# EAGLE design QiLiCape-main-v035 (EAGLE 6.3)
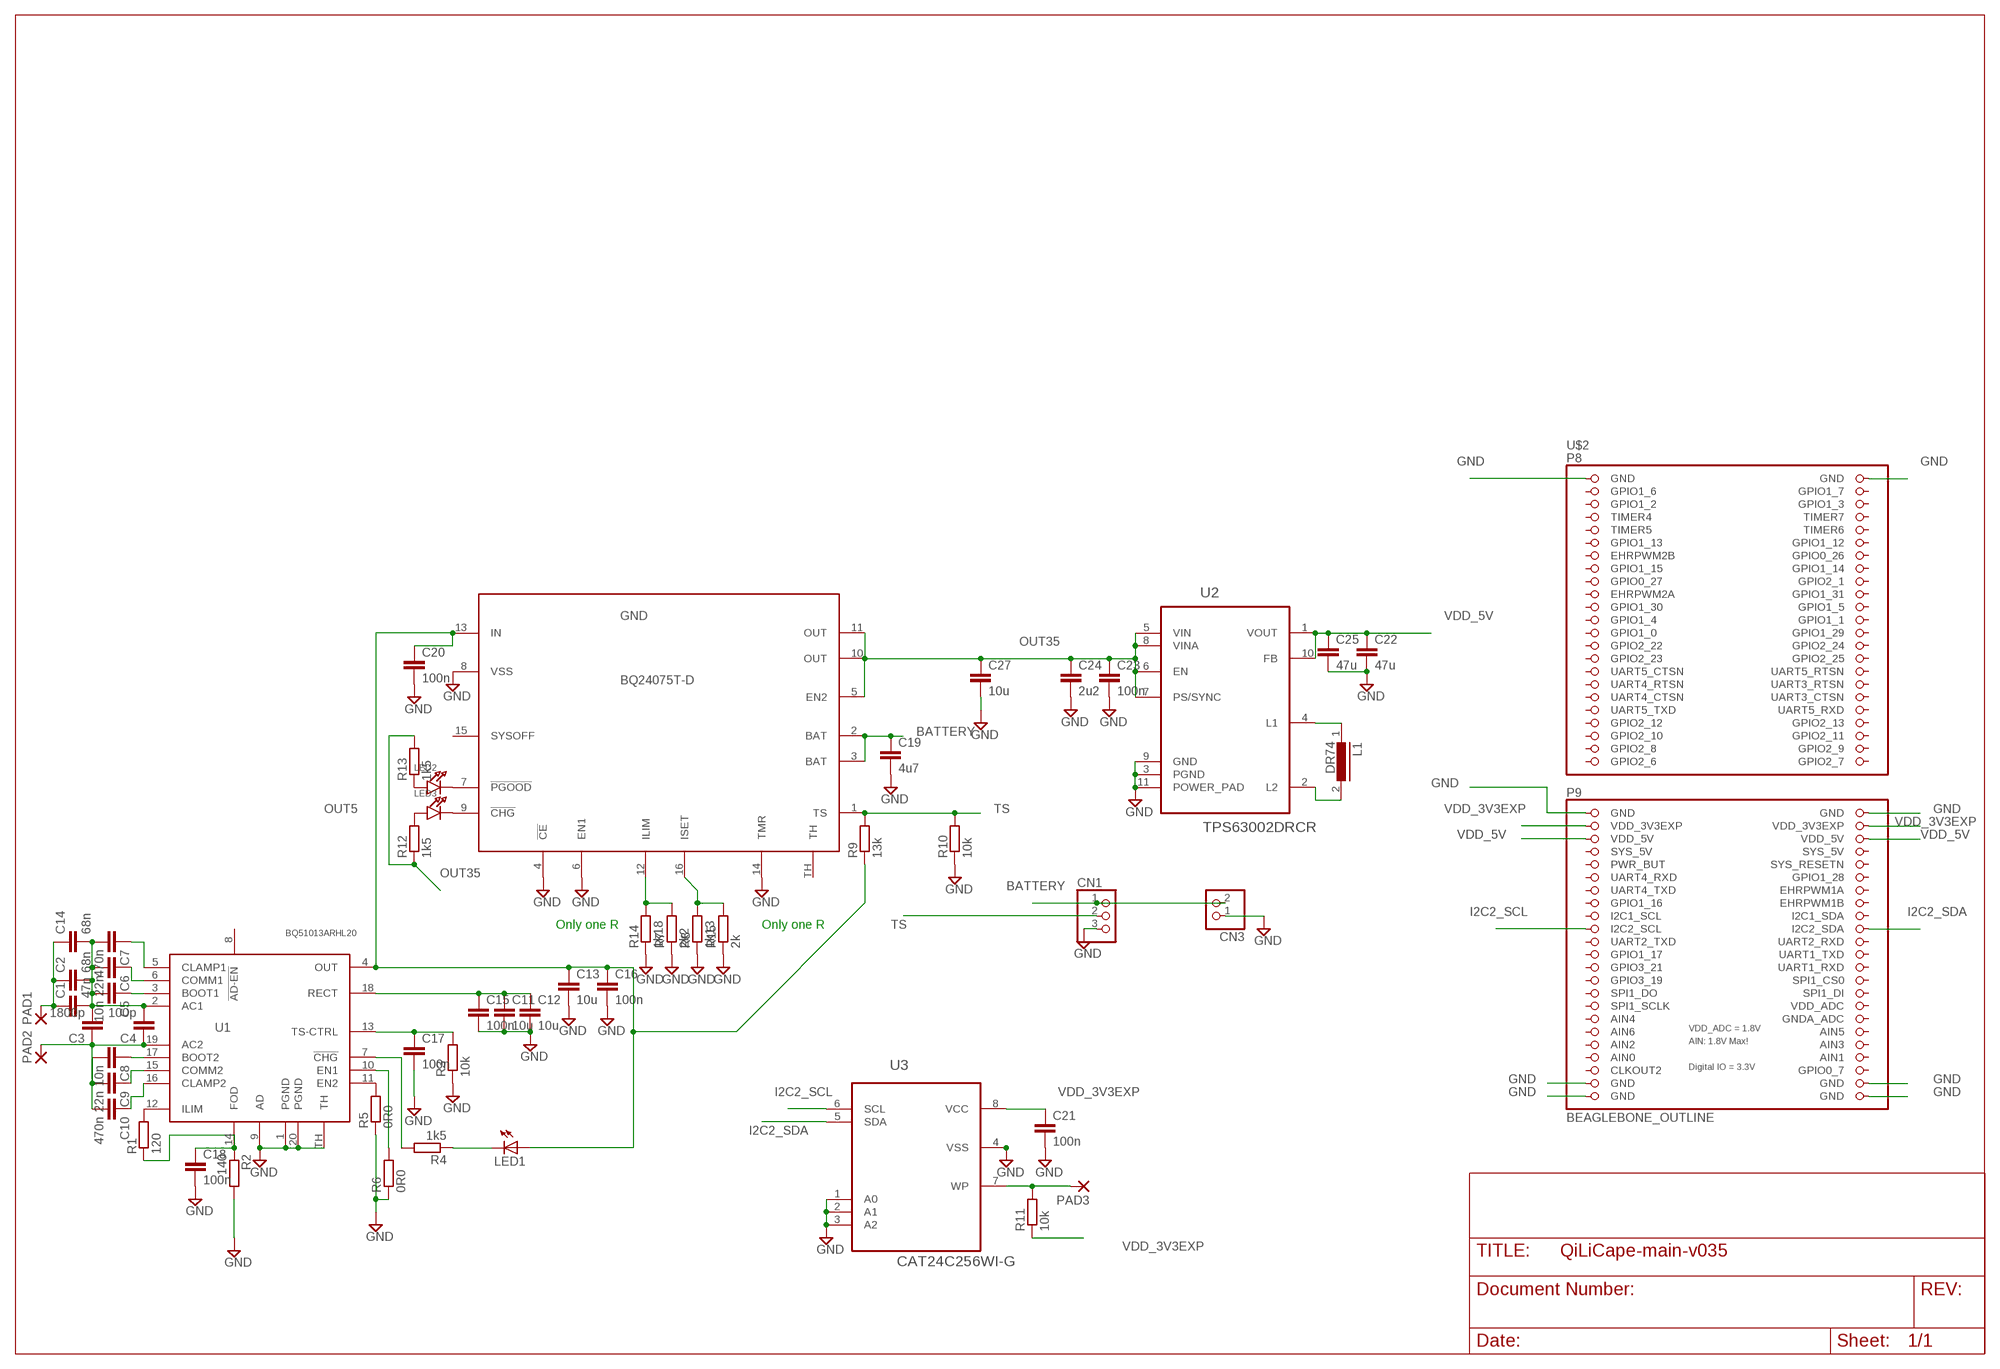
[diagram p0: schematic, sheet 1]

## Parts
C1  47n  C-EUC0603K  [C0603K]
C2  68n  C-EUC0603K  [C0603K]
C3  1800p  C-EUC0603K  [C0603K]
C4  100p  C-EUC0603K  [C0603K]
C5  10n  C-EUC0603K  [C0603K]
C6  22n  C-EUC0603K  [C0603K]
C7  470n  C-EUC0603K  [C0603K]
C8  10n  C-EUC0603K  [C0603K]
C9  22n  C-EUC0603K  [C0603K]
C10  470n  C-EUC0603K  [C0603K]
C11  10u  C-EUC1206  [C1206]
C12  10u  C-EUC1206  [C1206]
C13  10u  C-EUC1206  [C1206]
C14  68n  C-EUC0603K  [C0603K]
C15  100n  C-EUC0805K  [C0805K]
C16  100n  C-EUC0603K  [C0603K]
C17  100n  C-EUC0603K  [C0603K]
C18  100n  C-EUC0603K  [C0603K]
C19  4u7  C-EUC0805K  [C0805K]
C20  100n  C-EUC0603K  [C0603K]
C21  100n  C-EUC0402K  [C0402K]
C22  47u  C-EUC1206K  [C1206K]
C23  100n  C-EUC0603  [C0603]
C24  2u2  C-EUC0805K  [C0805K]
C25  47u  C-EUC1812K  [C1812K]
C27  10u  C-EUC1206K  [C1206K]
CN1  JST_3PIN  [JSTPH3]
CN3  JST_2PIN  [JSTPH2]
GND  BQ24075T-D  [QFN16-3]
L1  DR74  [DR74]
LED1  LEDSML0805  [SML0805]
LED2  LED0603  [CHIPLED_0603]
LED3  LED0603  [CHIPLED_0603]
PAD1  2,54/1,0  [2,54/1,0]
PAD2  2,54/1,1  [2,54/1,1]
PAD3  SMD2  [SMD1,27-2,54]
R1  120  R-EU_R0603  [R0603]
R2  140  R-EU_R0603  [R0603]
R3  10k  R-EU_R0603  [R0603]
R4  1k5  R-EU_R0603  [R0603]
R5  0R0  R-EU_R0805  [R0805]
R6  0R0  R-EU_R0805  [R0805]
R7  2k2  R-EU_R0603  [R0603]
R8  1k13  R-EU_R0603  [R0603]
R9  13k  R-EU_R0603  [R0603]
R10  10k  R-EU_R0603  [R0603]
R11  10k  R-EU_R0402  [R0402]
R12  1k5  R-EU_R0603  [R0603]
R13  1k5  R-EU_R0603  [R0603]
R14  1k18  R-EU_R0603  [R0603]
R15  2k  R-EU_R0603  [R0603]
U1  BQ51013ARHL20  [RHL]
U2  TPS63002DRCR  [SON50P300X300X100-11N]
U3  CAT24C256WI-G  [SOIC127P600X175-8N]
U$2  BEAGLEBONE_OUTLINE  [BEAGLEBONE_SHIELD]

## Nets
AC1: C1.2 C2.2 C3.2 C4.2 C5.2 C6.2 C7.2 C14.2 U1.2(AC1)
AC1-1: C1.1 C2.1 C14.1 PAD1.1(P)
AC2: C3.1 C4.1 C8.2 C9.2 C10.2 PAD2.1(P) U1.19(AC2)
BATTERY: C19.1 CN1.1 CN3.2 GND.2(BAT) GND.3(BAT)
GND: C11.2 C12.2 C13.2 C15.2 C16.2 C17.2 C18.2 C19.2 C20.2 C21.2 C22.2 C23.2 C24.2 C25.2 C27.2 CN1.3 CN3.1 GND.4(!CE) GND.6(EN1) GND.8(VSS) GND.14(TMR) R2.2 R3.1 R5.1 R6.1 R7.1 R8.1 R10.1 R14.1 R15.1 U1.1(PGND) U1.9(AD) U1.20(PGND) U1.TH U2.3(PGND) U2.9(GND) U2.11(POWER_PAD) U3.1(A0) U3.2(A1) U3.3(A2) U3.4(VSS) U$2.1(GND) U$2.2(GND) U$2.47(GND) U$2.48(GND) U$2.89(GND) U$2.90(GND) U$2.91(GND) U$2.92(GND)
I2C2_SCL: U3.6(SCL) U$2.65(I2C2_SCL)
I2C2_SDA: U3.5(SDA) U$2.66(I2C2_SDA)
N$1: C11.1 C12.1 C15.1 U1.18(RECT)
N$2: C5.1 U1.3(BOOT1)
N$3: C6.1 U1.6(COMM1)
N$4: C7.1 U1.5(CLAMP1)
N$5: C8.1 U1.17(BOOT2)
N$6: C9.1 U1.15(COMM2)
N$7: C10.1 U1.16(CLAMP2)
N$10: C17.1 R3.2 U1.13(TS-CTRL)
N$14: GND.7(!PGOOD) LED2.C
N$15: LED1.C R4.1
N$16: R4.2 U1.7(!CHG!)
N$17: R6.2 U1.10(EN1)
N$18: R5.2 U1.11(EN2)
N$19: PAD3.1(P) R11.2 U3.7(WP)
N$20: GND.12(ILIM) R7.2 R14.2
N$21: GND.16(ISET) R8.2 R15.2
N$24: L1.1 U2.4(L1)
N$25: L1.2 U2.2(L2)
N$26: GND.9(!CHG) LED3.C
N$27: LED3.A R12.2
N$29: LED2.A R13.1
N$33: R1.2 U1.12(ILIM)
N$34: C18.1 R1.1 R2.1 U1.14(FOD)
OUT5: C13.1 C16.1 C20.1 GND.13(IN) LED1.A R9.1 U1.4(OUT)
OUT35: C23.1 C24.1 C27.1 GND.5(EN2) GND.10(OUT) GND.11(OUT) R12.1 R13.2 U2.5(VIN) U2.6(EN) U2.7(PS/SYNC) U2.8(VINA)
TS: CN1.2 GND.1(TS) R9.2 R10.2
VDD_3V3EXP: C21.1 R11.1 U3.8(VCC) U$2.49(VDD_3V3EXP) U$2.50(VDD_3V3EXP)
VDD_5V: C22.1 C25.1 U2.1(VOUT) U2.10(FB) U$2.51(VDD_5V) U$2.52(VDD_5V)
Unconnected: GND.15(SYSOFF) GND.TH U1.8(!AD-EN!) U$2.3(GPIO1_6) U$2.4(GPIO1_7) U$2.5(GPIO1_2) U$2.6(GPIO1_3) U$2.7(TIMER4) U$2.8(TIMER7) U$2.9(TIMER5) U$2.10(TIMER6) U$2.11(GPIO1_13) U$2.12(GPIO1_12) U$2.13(EHRPWM2B) U$2.14(GPIO0_26) U$2.15(GPIO1_15) U$2.16(GPIO1_14) U$2.17(GPIO0_27) U$2.18(GPIO2_1) U$2.19(EHRPWM2A) U$2.20(GPIO1_31) U$2.21(GPIO1_30) U$2.22(GPIO1_5) U$2.23(GPIO1_4) U$2.24(GPIO1_1) U$2.25(GPIO1_0) U$2.26(GPIO1_29) U$2.27(GPIO2_22) U$2.28(GPIO2_24) U$2.29(GPIO2_23) U$2.30(GPIO2_25) U$2.31(UART5_CTSN) U$2.32(UART5_RTSN) U$2.33(UART4_RTSN) U$2.34(UART3_RTSN) U$2.35(UART4_CTSN) U$2.36(UART3_CTSN) U$2.37(UART5_TXD) U$2.38(UART5_RXD) U$2.39(GPIO2_12) U$2.40(GPIO2_13) U$2.41(GPIO2_10) U$2.42(GPIO2_11) U$2.43(GPIO2_8) U$2.44(GPIO2_9) U$2.45(GPIO2_6) U$2.46(GPIO2_7) U$2.55(PWR_BUT) U$2.56(SYS_RESETN) U$2.57(UART4_RXD) U$2.58(GPIO1_28) U$2.59(UART4_TXD) U$2.60(EHRPWM1A) U$2.61(GPIO1_16) U$2.62(EHRPWM1B) U$2.63(I2C1_SCL) U$2.64(I2C1_SDA) U$2.67(UART2_TXD) U$2.68(UART2_RXD) U$2.69(GPIO1_17) U$2.70(UART1_TXD) U$2.71(GPIO3_21) U$2.72(UART1_RXD) U$2.73(GPIO3_19) U$2.74(SPI1_CS0) U$2.75(SPI1_DO) U$2.76(SPI1_DI) U$2.77(SPI1_SCLK) U$2.79(AIN4) U$2.81(AIN6) U$2.82(AIN5) U$2.83(AIN2) U$2.84(AIN3) U$2.85(AIN0) U$2.86(AIN1) U$2.87(CLKOUT2) U$2.88(GPIO0_7)

## Notes on the sheet
- Only one R | Only one R

## Power pins joined to a net without a drawn wire
GNDA_ADC: U$2.80(GNDA_ADC)
SYS_5V: U$2.53(SYS_5V) U$2.54(SYS_5V)
VDD_ADC: U$2.78(VDD_ADC)

## Library data of the parts
C1-C25 C27 = rcl:C-EU: CAPACITOR, European symbol
CN1 = microbuilder:JST_3PIN
CN3 = microbuilder:JST_2PIN: JST 2-Pin Right-Angle Connector PH-Series - 4UConnector: 17311 SH-Series - 4UConnector: 07278
GND = new_qili:BQ24075T-D: Texas Instruments BQ24075T according to www.ti.com/lit/ds/symlink/bq24072t.pdf QFN 3x3mm RGT open source | free download @ ioclk.com
L1 = inductors:DR74: High Power Density, High Efficiency, Shielded Inductors Source: coiltronics_dr_series.pdf
LED1 = led:LED: LED
LED2 LED3 = microbuilder:LED: LED
PAD1 = wirepad:2,54/1,0: THROUGH-HOLE PAD
PAD2 = wirepad:2,54/1,1: THROUGH-HOLE PAD
PAD3 = wirepad:SMD2: SMD PAD
R1-R3 R5-R15 = rcl:R-EU_: RESISTOR, European symbol
R4 = resistor:R-EU_: RESISTOR, European symbol
U1 = new_qili:BQ51013A: TI bq51013a wireless power receiver According to: http://www.ti.com/product/bq51013a Footprint according to: http://www.ti.com/litv/pdf/mpqf155i and http://www.ti.com/lit/an/scba017d/scba017d.pdf pads: 1x2.9x1.9 + 20x0.85x0.30 open source | free download @ ioclk.com
U2 = new_qili:TPS63002DRCR: HIGH EFFICIENT SINGLE INDUCTOR BUCK-BOOST CONVERTER WITH 1.8-A SWITCHES; MPN: TPS63002DRCR; OC_FARNELL: 1576333; OC_NEWARK: 85K1713; PACKAGE: SON-10; SUPPLIER: TEXAS INSTRUMENTS
U3 = new_qili:CAT24C256WI-G: 256-Kb I2C CMOS Serial EEPROM; MPN: CAT24C256WI-G; OC_FARNELL: 1631142; OC_NEWARK: 06R0552; PACKAGE: SOIC-8; SUPPLIER: CATALYST SEMICONDUCTOR
U$2 = new_qili:BEAGLEBONE_OUTLINE

## Board
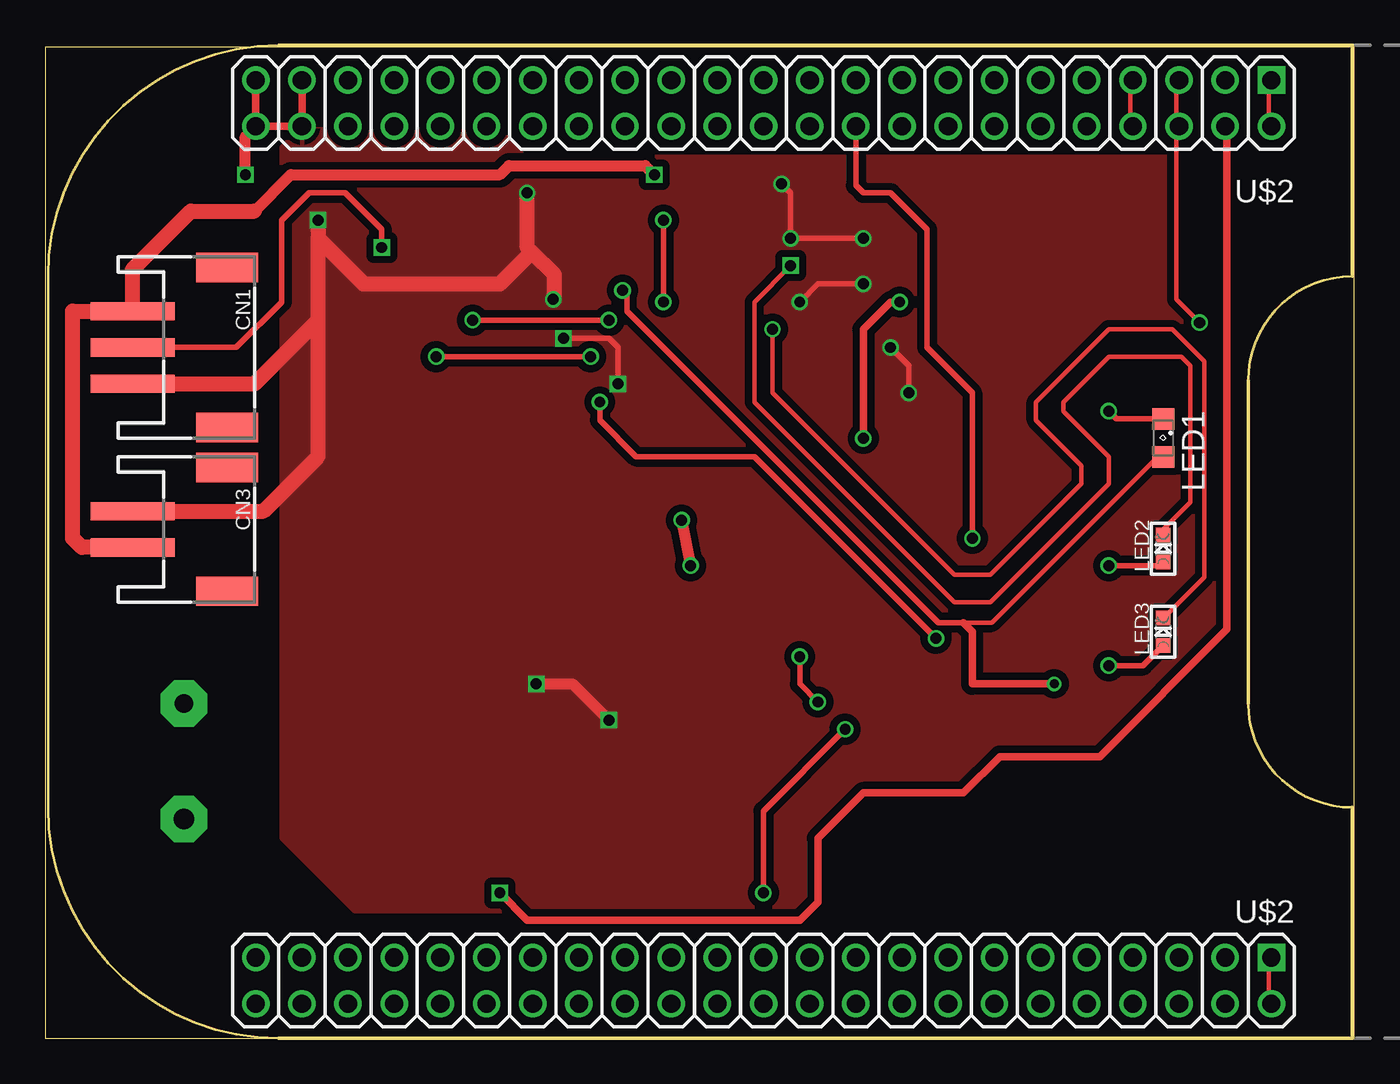
[diagram p1: board, top side]
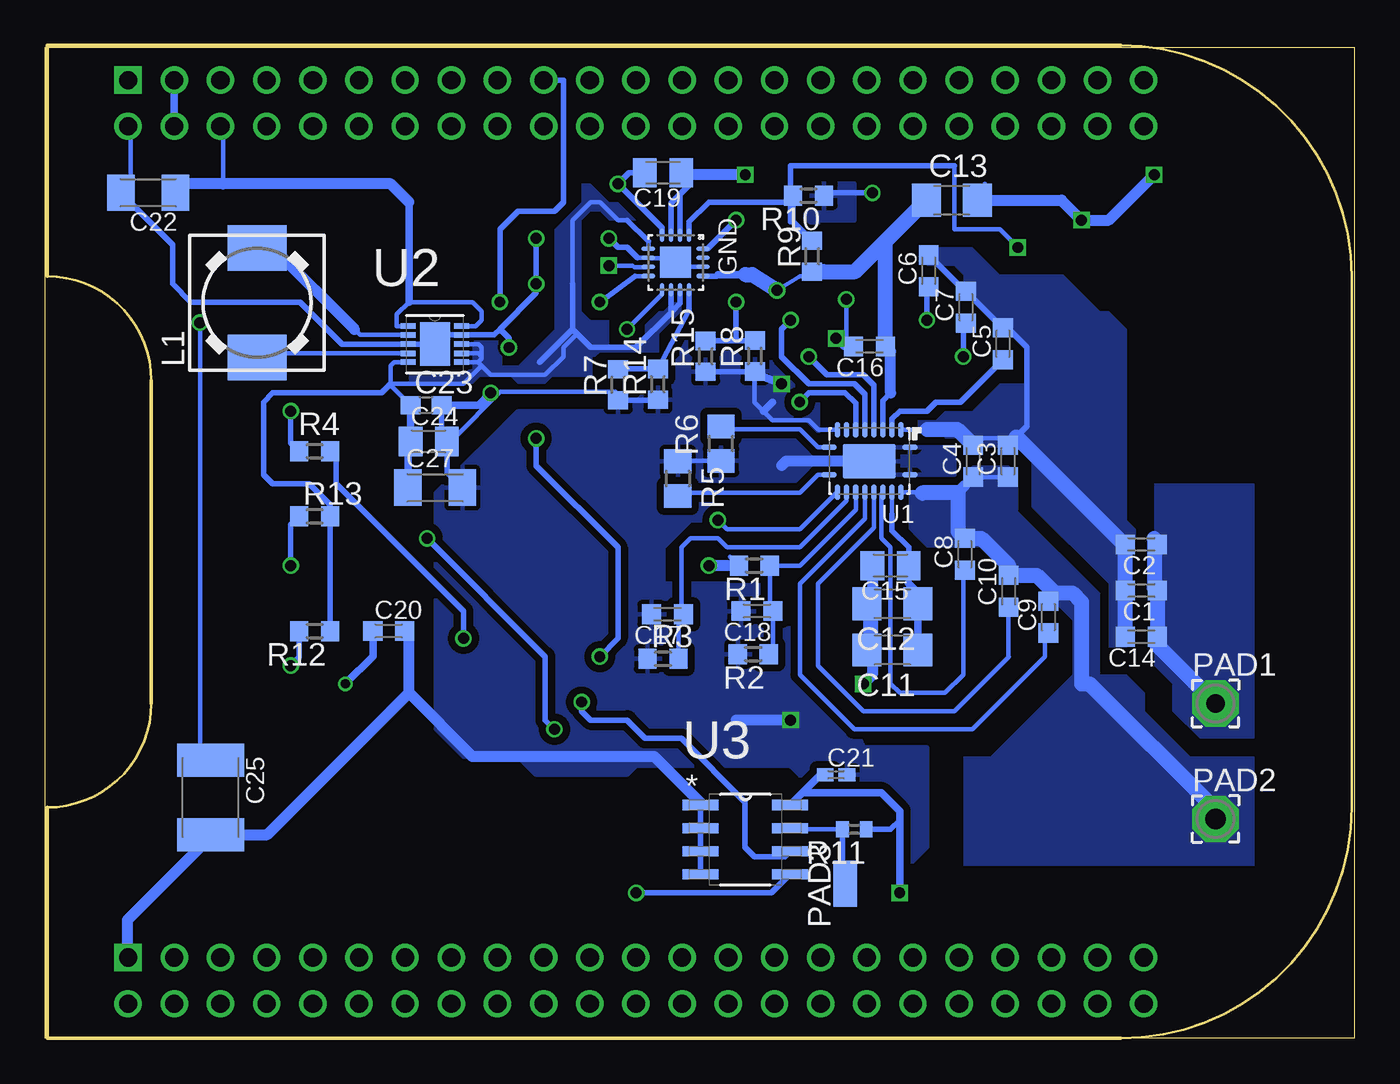
[diagram p2: board, bottom side, seen from below]

Size 72 x 54.5 mm. Coordinates in mm from the lower left corner, seen from the top.
Outline: 0,0 72,0 72,54.5 0,54.5 0,0
Copper layers (1*16): Top 0.035mm / dielectric 1.5mm / Bottom 0.035mm
Design rules "Fusion_eagle_rule_v1.1": minimum track width 6mil, minimum drill 12mil, track to track 6mil, track to pad 6mil, pad to pad 6mil, via to via 6mil, smd to smd 0mil, copper to edge 10mil, drill to drill 10mil, minimum pad ring 10mil, minimum via ring 6mil, stop-mask expansion 2mil, vias tented up to drill 100mil, thermal gap 10mil

### Footprints (pad centres in the part's own frame; a part is rotated, then mirrored left to right if it is on the bottom)
C0603K = smd 1.05 x 1.08: 1 -0.875,0; 2 0.875,0
C1206 = smd 1.6 x 1.8: 1 -1.4,0; 2 1.4,0
C0805K = smd 1.3 x 1.6: 1 -1,0; 2 1,0
C0402K = smd 0.925 x 0.74: 1 -0.6,0; 2 0.6,0
C1206K = smd 1.5 x 2: 1 -1.5,0; 2 1.5,0
C0603 = smd 1.1 x 1: 1 -0.85,0; 2 0.85,0
C1812K = smd 1.8 x 3.7: 1 -2.05,0; 2 2.05,0
JSTPH3 = smd 1 x 4.6: 1 -2,-2.7; 2 0,-2.7; 3 2,-2.7 | smd 1.6 x 3.4: NC1 -4.4,2.5; NC2 4.4,2.5
JSTPH2 = smd 1 x 4.6: 1 -1,-3.7; 2 1,-3.7 | smd 1.6 x 3.4: NC1 -3.4,1.5; NC2 3.4,1.5
QFN16-3 = smd 0.75 x 0.25: 1 -1.5,0.75; 2 -1.5,0.25; 3 -1.5,-0.25; 4 -1.5,-0.75; 9 1.5,-0.75; 10 1.5,-0.25; 11 1.5,0.25; 12 1.5,0.75 | smd 0.25 x 0.75: 5 -0.75,-1.5; 6 -0.25,-1.5; 7 0.25,-1.5; 8 0.75,-1.5; 13 0.75,1.5; 14 0.25,1.5; 15 -0.25,1.5; 16 -0.75,1.5 | smd 1.7 x 1.7: TH 0,0
DR74 = smd 2.5 x 3.25: 1 -3,0; 2 3,0
SML0805 = smd 1.2 x 1.2: A 1.05,0; C -1.05,0
CHIPLED_0603 = smd 0.8 x 0.8: A 0,-0.75; C 0,0.75
2,54/1,0 = drill 1.016 pad 2.54 octagon: 1 0,0
2,54/1,1 = drill 1.118 pad 2.54 octagon: 1 0,0
SMD1,27-2,54 = smd 1.27 x 2.54: 1 0,0
R0603 = smd 1 x 1.1: 1 -0.85,0; 2 0.85,0
R0805 = smd 1.3 x 1.5: 1 -0.95,0; 2 0.95,0
R0402 = smd 0.7 x 0.9: 1 -0.65,0; 2 0.65,0
RHL = smd 0.85 x 0.3: 1 -2.223,-0.75; 10 2.223,-0.75; 11 2.223,0.75; 20 -2.223,0.75 | smd 0.3 x 0.85: 2 -1.75,-1.715; 3 -1.25,-1.715; 4 -0.75,-1.715; 5 -0.25,-1.715; 6 0.25,-1.715; 7 0.75,-1.715; 8 1.25,-1.715; 9 1.75,-1.715; 12 1.75,1.715; 13 1.25,1.715; 14 0.75,1.715; 15 0.25,1.715; 16 -0.25,1.715; 17 -0.75,1.715; 18 -1.25,1.715; 19 -1.75,1.715 | smd 2.9 x 1.9: TH 0,0
SON50P300X300X100-11N = smd 0.813 x 0.305: 1 -1.473,0.991; 2 -1.473,0.508; 3 -1.473,0; 4 -1.473,-0.508; 5 -1.473,-0.991; 6 1.473,-0.991; 7 1.473,-0.508; 8 1.473,0; 9 1.473,0.508; 10 1.473,0.991 | smd 1.651 x 2.388: 11 0,0
SOIC127P600X175-8N = smd 1.981 x 0.559: 1 -2.464,1.905; 2 -2.464,0.635; 3 -2.464,-0.635; 4 -2.464,-1.905; 5 2.464,-1.905; 6 2.464,-0.635; 7 2.464,0.635; 8 2.464,1.905
BEAGLEBONE_SHIELD = drill 1 square: 1 4.445,19.05; 47 52.705,19.05 | drill 1: 2 1.905,19.05; 3 4.445,21.59; 4 1.905,21.59; 5 4.445,24.13; 6 1.905,24.13; 7 4.445,26.67; 8 1.905,26.67; 9 4.445,29.21; 10 1.905,29.21; 11 4.445,31.75; 12 1.905,31.75; 13 4.445,34.29; 14 1.905,34.29; 15 4.445,36.83; 16 1.905,36.83; 17 4.445,39.37; 18 1.905,39.37; 19 4.445,41.91; 20 1.905,41.91; 21 4.445,44.45; 22 1.905,44.45; 23 4.445,46.99; 24 1.905,46.99; 25 4.445,49.53; 26 1.905,49.53; 27 4.445,52.07; 28 1.905,52.07; 29 4.445,54.61; 30 1.905,54.61; 31 4.445,57.15; 32 1.905,57.15; 33 4.445,59.69; 34 1.905,59.69; 35 4.445,62.23; 36 1.905,62.23; 37 4.445,64.77; 38 1.905,64.77; 39 4.445,67.31; 40 1.905,67.31; 41 4.445,69.85; 42 1.905,69.85; 43 4.445,72.39; 44 1.905,72.39; 45 4.445,74.93; 46 1.905,74.93; 48 50.165,19.05; 49 52.705,21.59; 50 50.165,21.59; 51 52.705,24.13; 52 50.165,24.13; 53 52.705,26.67; 54 50.165,26.67; 55 52.705,29.21; 56 50.165,29.21; 57 52.705,31.75; 58 50.165,31.75; 59 52.705,34.29; 60 50.165,34.29; 61 52.705,36.83; 62 50.165,36.83; 63 52.705,39.37; 64 50.165,39.37; 65 52.705,41.91; 66 50.165,41.91; 67 52.705,44.45; 68 50.165,44.45; 69 52.705,46.99; 70 50.165,46.99; 71 52.705,49.53; 72 50.165,49.53; 73 52.705,52.07; 74 50.165,52.07; 75 52.705,54.61; 76 50.165,54.61; 77 52.705,57.15; 78 50.165,57.15; 79 52.705,59.69; 80 50.165,59.69; 81 52.705,62.23; 82 50.165,62.23; 83 52.705,64.77; 84 50.165,64.77; 85 52.705,67.31; 86 50.165,67.31; 87 52.705,69.85; 88 50.165,69.85; 89 52.705,72.39; 90 50.165,72.39; 91 52.705,74.93; 92 50.165,74.93

### Placement (x,y rotation side)
C1  11.7,24.63 180 bottom
C2  11.7,27.17 180 bottom
C3  19.05,31.75 90 bottom
C4  20.95,31.75 90 bottom
C5  19.32,38.21 90 bottom
C6  23.4,42.21 90 bottom
C7  21.36,40.21 90 bottom
C8  21.41,26.63 90 bottom
C9  16.82,23.17 90 bottom
C10  19.01,24.59 90 bottom
C11  25.4,21.36 180 bottom
C12  25.4,23.9 180 bottom
C13  22.13,46.1 0 bottom
C14  11.7,22.09 180 bottom
C15  25.5,26 180 bottom
C16  26.67,38.06 180 bottom
C17  37.78,23.33 180 bottom
C18  32.85,23.5 180 bottom
C19  38.02,47.61 180 bottom
C20  53.11,22.4 0 bottom
C21  28.5,14.5 0 bottom
C22  66.35,46.51 180 bottom
C23  51.06,34.83 0 bottom
C24  50.91,32.83 0 bottom
C25  62.91,13.25 270 bottom
C27  50.56,30.29 0 bottom
CN1  7.5,38 270 top
CN3  8.5,28 270 top
GND  37.33,42.68 270 bottom
L1  60.36,40.46 90 bottom
LED1  61.5,33.02 270 top
LED2  61.5,26.94 0 top
LED3  61.5,22.36 0 top
PAD1  7.62,18.41 0 bottom
PAD2  7.62,12.06 0 bottom
PAD3  28,8.5 0 bottom
R1  33,26 180 bottom
R2  33.06,21.13 180 bottom
R3  38.02,20.87 0 bottom
R4  57.19,32.29 0 bottom
R5  37.21,30.79 270 bottom
R6  34.83,32.71 90 bottom
R7  40.49,35.95 90 bottom
R8  32.97,37.53 90 bottom
R9  29.82,43.02 90 bottom
R10  30.02,46.35 180 bottom
R11  27.5,11.5 180 bottom
R12  57.19,22.4 180 bottom
R13  57.19,28.71 0 bottom
R14  38.31,35.97 90 bottom
R15  35.68,37.51 90 bottom
U1  26.67,31.75 180 bottom
U2  50.57,38.18 0 bottom
U3  33.49,10.93 0 bottom
U$2  86.5,0 90 top

### Tracks (layer width: path | path; a pad name or v marks a point on that pad's centre or on a via)
AC1
  Bottom 0.254: C3.2 19.05,33.02 20.56,33.02 C4.2 | U1.2 23.54,33.47
  Bottom 0.305: C6.2 21.4,41.09 C7.2 19.36,39.09 C5.2 19.09,39.09 18,38 18,33.67 18.59,33.09 C3.2
  Bottom 0.406: 23.54,33.47 23.5,33.5
  Bottom 0.813: 23.5,33.5 21.83,33.5 C4.2 | C14.2 C1.2 C2.2 12.67,27.17 18.59,33.09
  pour Bottom (no thermals): 12.5,21.5 13.5,21.5 13.5,25 17.75,29.25 17.75,31.75 17.5,32 16,32 12,28 12,27.5 12.5,27
  pour Bottom (no thermals): 14,40 16,42 19.5,42 21,43.5 23.5,43.5 23.5,42.5 22,42.5 21.5,42 21.5,41 19.5,39 19,39 18,38 18,34 22.5,34 22.5,33 21.5,33 21,32.5 18,32.5 16,30.5 13.5,28 12.5,28 12.5,39 13.5,40
  pour Bottom (no thermals): 17.5,35.5 17.5,33.5 18,33 22,33 22.5,33.5 24,33.5 24,34 23,34 22.5,34.5 21,34.5 19.5,36 18,36 17.5,36.5
AC1-1
  Bottom 0: PAD1.1 7.62,18.89 | C2.1 10.82,27.32 11,27.5
  Bottom 0.813: 11,27.5 11,24.8 C1.1 C14.1 10.82,21.62 PAD1.1
  pour Bottom (no thermals): 5.5,16.5 8.5,16.5 10,18 10,19.5 11,20.5 11,30.5 5.5,30.5
AC2
  Bottom 0.254: C3.1 C4.1 21.41,30.41 21.8,30.04 | U1.19 24.04,30.04 23.75,29.75
  Bottom 0.406: 23.75,30 23.75,29.75
  Bottom 0.61: 21.83,30 21.41,30.41 | C9.2 16.82,24.18 16.5,24.5
  Bottom 0.813: 21.8,30.04 21.8,27.89 C8.2 20.5,27.5 19,26 19,25.48 C10.2 17.46,25.46 16.5,24.5 15.5,24.5 15,24 15,19.5 14.55,19.5 7.62,12.56 PAD2.1 | 21.83,30 23.75,30
  pour Bottom (isolate 0.12, no thermals): 20.5,27.5 18.5,25.5 17.5,25.5
  pour Bottom (isolate 1, no thermals): 5.5,15.5 5.5,9.5 21.5,9.5 21.5,15.5 20,15.5 15.5,20 12.5,20 11.5,19 11.5,18 9,15.5
  pour Bottom (no thermals): 14,24.5 18.5,29 18.5,31 19,31.5 21,31.5 21.5,31 21.5,30.5 22,30 23,30 24,29 24,27.5 23.5,27 20.5,27 20,27 19,26 18.5,26 18,25.5 17.5,25.5 16.5,24.5 16,24.5 15.5,24 15.5,17.5 14.5,17.5 14.5,19 14,19.5
  pour Bottom (no thermals): 16.5,24.5 16.5,24 15,22.5 14,23.5 16,25.5 16,25
  pour Bottom (no thermals): 23,30 24.5,30 24.5,28 23.5,27 22.5,27 22,27.5 22,30
BATTERY  (via drill 0.6)
  Top 0.61: 11.5,45.5 13.5,47.5 25,47.5 25.5,48 33,48 v33.5,47.5
  Top 0.813: CN3.2 2,27 1.5,27.5 1.5,40 CN1.1 4.8,42.3 8,45.5 11.5,45.5
  Bottom 0.305: GND.2 37.08,46.42 | GND.3 37.58,45.92 37.08,46.42 | C19.1 36.52,47.52 36.5,47.5 36.5,47 37.08,46.42
  Bottom 0.61: v33.5,47.5 36.91,47.5 C19.1
  pour Top (no thermals): 3,27.5 4.5,26.5 4.5,27
GND  (via drill 0.6, 0.61)
  Top 0: U$2.2 67.41,1.91 67.31,2
  Top 0.254: 67.31,4.45 67.31,3.81 | 67.31,3.81 67.31,2 67.31,1.91 | 67.31,3.81 U$2.1 | U$2.48 67.31,50.8 67.31,52.07 U$2.47
  Top 0.305: v40.5,47 41,46.5 v41,44 v45,44 | v45,41.5 42.5,41.5 v41.5,40.5 | v46.5,38 47.5,37 v47.5,35.5 | v28.5,38.5 31,38.5 31.5,38 v31.5,36
  Top 0.406: U$2.91 U$2.92 | U$2.92 U$2.90 U$2.89 | 11,49.59 U$2.92
  Top 0.61: 15,44.5 v15,45 | v11,47.5 11,49.59 | 28,40.7 v27.94,40.64 | v27,19.5 29,19.5 v31,17.5
  Top 0.813: 28,40.7 28,42 26.75,43.25 | 26.75,43.25 26.5,43.5 v26.5,46.5 | 15,44.5 15,44 | 15,44 17.5,41.5 25,41.5 26.75,43.25 | CN3.1 12,29 15,32 15,39.5 | 15,39.5 15,44 | CN1.3 11.5,36 15,39.5
  Bottom 0.254: R6.1 37.19,31.76 R5.1 | 20.32,46.99 C13.2 | U$2.48 67.31,49.53 67.31,46.99 C22.2 | C24.2 49.53,33.02 46.99,35.56 40.64,35.56 R7.1 | v27.94,40.64 27.94,38.1 C16.2 | U1.9 29.46,33.47 30,34 32,34 32.5,34.5 33,35 33,36.65 R8.1 | GND.14 36.93,42.43 37.5,43 37.5,42.5 37.9,42.9 38.8,42.9 GND.6 | GND.6 38.93,42.93 | 39.43,42.93 GND.6 | 39.57,41.93 GND.8
  Bottom 0.305: R7.1 38.33,35.1 R14.1 | R15.1 32.99,36.66 R8.1 | 39.57,41.93 v41.5,40.5 | 39.43,42.93 40,43.5 40.5,43.5 v41,44 | GND.4 38.08,44.58 v40.5,47 39.89,47.61 C19.2 | v45,44 v45,41.5 45,41 47,39 | C22.2 65,43.66 65,41.5 64,40.5 58,40.5 55.68,38.18 U2.3 U2.11 | U2.11 50.06,38.69 U2.9 47.31,38.69 47,39 | U2.11 50.57,38.07 50.5,38 | U3.1 U3.2 U3.3 U3.4 | C23.2 50.21,33.13 C24.2 49.91,31.14 C27.2 | 47,39 46.5,38.5 v46.5,38 | v26.5,46.5 29.02,46.5 R10.1 | C15.2 26.5,24.2 C12.2
  Bottom 0.406: C23.2 48.17,34.83 v47.5,35.5 | 32.5,34.5 32,35 | C16.2 28.06,38.06 v28.5,38.5 | v31.5,36 32.79,36.5 R8.1 | C11.2 C12.2
  Bottom 0.61: U$2.1 67.5,4.5 67.5,6.5 62.91,11.09 C25.2 59.8,11.2 52,19 | 52,19 52,22.16 C20.2 | v11,47.5 13.5,45 v15,45 16.1,46.1 C13.2 | 33.91,23.32 C18.2 | U1.TH 31.25,31.75 31.5,31.5 | C15.2 26.5,20 v27,19.5 | v31,17.5 34,17.5 | 34,21.04 R2.2 | U3.1 35.95,12.95 38.5,15.5 48.5,15.5 52,19
  pour Bottom (no thermals): 26,31 27.5,31 28,31.5 26.5,31.5 25.5,32.5
  pour Bottom (isolate 0.4): 27.5,45 29.5,45 29.5,34.5 29.5,30 31,28.5 36.5,28.5 38,27 38,25 31,25 27,16 23.5,16 23.5,10.5 26.5,7.5 29.5,7.5 29.5,13.5 31,15 39.5,15 40,14.5 45,14.5 46,15.5 49,15.5 50.5,17 50.5,30 46,34.5 40,34.5 37,37.5 37,38.5 35,40.5 35,44.5 32.5,47 27.5,47
  pour Top (isolate 0.4): 13,49 13,11 17,7 64.5,7 67.5,10 67.5,48 67,48.5 26.5,48.5 25,50 14,50
  pour Bottom: 22,32.5 22,31 26.5,31 26.5,32.5
I2C2_SCL  (via drill 0.6)
  Top 0.305: 45,36.5 v45,33 | v41.5,21 41.5,19.5 v42.5,18.5
  Top 0.406: v47,40.5 46.5,40.5 45,39 v45,33
  Bottom 0.305: U$2.65 43.5,52.7 43.5,46 44,45.5 46,45.5 47,44.5 v47,40.5 | v45,33 45,31.5 40.5,27 40.5,22 v41.5,21 | U3.6 31.32,10 33,10 33.5,10.5 33.5,13 37,16.5 39,16.5 40,17.5 42,17.5 42.5,18 v42.5,18.5
I2C2_SDA  (via drill 0.6)
  Top 0.305: U$2.66 44.59,46.91 45,46.5 46.5,46.5 48.5,44.5 48.5,38 51,35.5 v51,27.5 | v44,17 39.5,12.5 v39.5,8
  Bottom 0.305: v51,27.5 44.5,21 44.5,17.5 v44,17 | v39.5,8 32.05,8 U3.5
N$1
  Bottom 0.254: U1.18 25.42,28.84
  Bottom 0.305: C12.1 24.5,24.4 C15.1 24.5,27 25.42,27.92 25.42,28.84
  Bottom 0.406: 24.52,25.02 23.5,24 23.9,24 C12.1 C11.1
N$2
  Bottom 0.305: U1.3 25.42,34.08 25,34.5 23.5,34.5 23,35 21.66,35 C5.1
N$3  (via drill 0.6)
  Top 0.305: v31,39.5 v23.5,39.5
  Bottom 0.305: U1.6 26.92,35.42 27.5,36 30,36 31.5,37.5 31.5,39 v31,39.5 | v23.5,39.5 23.5,41.23 C6.1
N$4  (via drill 0.6)
  Top 0.305: v30,37.5 v21.5,37.5
  Bottom 0.305: U1.5 26.42,35.92 27,36.5 29,36.5 v30,37.5 | v21.5,37.5 21.5,39.2 C7.1
N$5
  Bottom 0.254: U1.17 26,29.95 26,27.5 25.5,27 25.5,19.5 25,19 22.5,19 21.5,20 21.5,25.67 C8.1
N$6
  Bottom 0.254: U1.15 26.92,28.58 30.5,25 30.5,20 27.5,17 21,17 17,21 17,22.11 C9.1
N$7
  Bottom 0.254: U1.16 26.42,28.08 29.5,25 29.5,20.5 27,18 22,18 19,21 19.01,21.01 C10.1
N$10
  Bottom 0.254: R3.2 37.17,23.07 C17.1 37,23.43 37,27 36.5,27.5 35,27.5 34.5,27 30.5,27 27.92,29.58 U1.13
N$14  (via drill 0.6)
  Top 0.254: LED2.C 61.5,28 63,29.5 63,37 62.5,37.5 58.5,37.5 56,35 56,34.5 58.5,32 58.5,30.5 52,24 50,24 39,35 39,40.5 v41,42.5
  Bottom 0.254: v41,42.5 39.7,42.5 39.6,42.4 38.86,42.4 GND.7
N$15  (via drill 0.6)
  Top 0.305: LED1.C 58.93,34.07 v58.5,34.5
  Bottom 0.305: v58.5,34.5 58.5,32.75 R4.1
N$16  (via drill 0.6)
  Top 0.305: v30.5,35 30.5,34 32.5,32 39,32 v49,22
  Bottom 0.305: U1.7 27.42,34.92 28,35.5 30,35.5 v30.5,35 | v49,22 49,23.5 56,30.5 56,31.95 R4.2
N$17
  Bottom 0.254: U1.10 29.5,32.5 30.5,33.5 34.67,33.5 R6.2
N$18
  Bottom 0.254: U1.11 29.5,31 30.5,30 37.05,30 R5.2 36.87,29.5
N$19
  Bottom 0.254: R11.2 30.96,11.5 U3.7
  Bottom 0.305: R11.2 28.15,8.65 PAD3.1
N$20
  Bottom 0.305: GND.12 36.58,40.05 R14.2 40.47,36.82 R7.2
N$21  (via drill 0.6)
  Top 0.305: v34,45 v34,40.5
  Bottom 0.305: R8.2 34,38.38 | 34,38.38 35.66,38.38 R15.2 | GND.16 35.57,43.43 v34,45 | v34,40.5 34,38.38
N$24
  Bottom 0.254: U2.4 59.33,37.67 59.5,37.5 60.32,37.5 L1.1
  Bottom 0.406: 60.15,37.67 L1.1
N$25
  Bottom 0.254: U2.2 54.69,38.69 55,39
  Bottom 0.61: L1.2 59.46,43.46 55,39
N$26  (via drill 0.6)
  Top 0.254: v40,39 40,35.5 50,25.5 52,25.5 57,30.5 57,31.5 54.5,34 54.5,35 58.5,39 62,39 63.75,37.25 63.75,25.36 LED3.C
  Bottom 0.254: GND.9 38.08,40.92 v40,39
N$27  (via drill 0.6)
  Top 0.305: v58.5,20.5 60.39,20.5 LED3.A
  Bottom 0.305: R12.2 58.04,20.96 v58.5,20.5
N$29  (via drill 0.6)
  Top 0.305: LED2.A 61.5,26 v58.5,26
  Bottom 0.305: v58.5,26 58.5,28.25 R13.1
N$33  (via drill 0.6)
  Top 0.61: v35,28.5 v35.5,26
  Bottom 0.254: U1.12 28.46,30.04 30.5,28 34.5,28 v35,28.5 | 34.35,26.5 R1.2
  Bottom 0.61: R1.2 v35.5,26
N$34
  Bottom 0.254: U1.14 27.42,29.08 30.5,26 R1.1 32.15,23.68 C18.1 31.98,21.36 R2.1
OUT5  (via drill 0.5, 0.61)
  Top 0.254: 50.5,22.86 52.07,22.86 60.96,31.75 LED1.A
  Top 0.305: 50.5,22.86 49.14,22.86 32,40 32,40.89 v31.75,41.14
  Top 0.406: v55.5,19.5 51,19.5 51,22.36 50.5,22.86
  Bottom 0.254: v31.75,41.14 30.48,41.91 29.21,41.91 29.21,42.17
  Bottom 0.305: U1.4 25.92,35.08 25.5,35.5 | GND.13 35.07,41.93 35,42
  Bottom 0.406: 35,42 33.5,42 | C20.1 53.98,21.02 v55.5,19.5
  Bottom 0.61: 25.5,35.5 25.5,37.77 C16.1
  Bottom 0.813: C16.1 25.8,43.84 | 25.8,43.84 C13.1 | R9.1 29.21,42.17 27.46,42.17 25.8,43.84 | 33.5,42 33.11,42 v31.75,41.14
OUT35
  Bottom 0.254: 52.07,30.48 C27.1 | 52.07,33.02 C24.1 | 40,45 40.5,45 41.5,46 42,46 43,45 43,41.5 | U2.6 48.19,37.19 | 48.19,37.19 48,37 | 48,37 47.5,36.5 44.5,36.5 43.5,37.5 43.5,38 42.75,38.75 | U2.8 48.18,38.18 48,38 48,37.5 | 48,37.5 48,37.38 48.19,37.19 | U2.7 48.17,37.67 48,37.5 | 53,36 53,35.92 C23.1 | U2.5 52.81,37.19 53,37 53,36 | 53,36 49,36 48,37 | GND.5 38.83,43.83
  Bottom 0.305: GND.11 37.08,40.42 37.58,39.92 | GND.10 37.58,39.92 | 37.58,39.92 39.5,38 42,38 42.75,38.75 43,39 | 38.83,43.83 40,45 | 43,39 43,41.5 | C27.1 52.06,30.44 52,30.5 | 43,39 44.81,37.19 | R12.1 R13.2 56.34,29.34 57.5,30.5 59.5,30.5 60,31 60,35 59.5,35.5 53.5,35.5 53,36
  Bottom 0.406: C23.1 C24.1 | 52.07,33.02 52.06,33.02 C27.1
  pour Bottom: 39.5,45 40.5,46 41,46 42,47 42.5,47 42.5,46 43,45.5 44,44.5 44,39.5 44,39 45.5,37.5 46,37 47.5,37 48,37.5 48,36.5 47,36.5 46.5,36.5 46,36 44.5,36 43.5,37 43.5,37.5 43,38 42.5,37.5 42,37.5 41.5,38 41.5,38.5 41,39 41,39.5 42,39.5 42.5,40 42.5,44.5 42.5,45 42,45.5 41.5,45.5 41,45
  pour Bottom: 42,38 42,36.5 44.5,36.5 44.5,37.5 44,37.5 42.5,39 42.5,38.5
  pour Bottom: 37,40.5 37.5,40.5 38,40 38.25,40 39,39.25 39,38.75 39.75,38 39.5,37.75 38.25,37.75 38.25,38.75 37,40
  pour Bottom: 41,39 41,38 42,38 42,38.5 42.5,39
  pour Bottom: 39.5,38 42,38 42,37.5 41.75,37.5 41.5,37.75 39.5,37.75
  pour Bottom: 48,37.5 48.25,37.25 48.25,36.75 48,36.5 48,36.75 47.75,37 47.75,37.25
  pour Bottom: 48,37 48.5,37 49,36.5 49.5,36.5 52,36.5 52,36 48.5,36 48,36.5
  pour Bottom (no thermals): 47.5,38 47.75,38.25 48.25,38.25 48.25,37.25 48.25,36.75 48,37 47.25,37 47,36.75 47,37 47.5,37.5
  pour Bottom (no thermals): 47.5,38.25 48.5,38.25 48.5,36.75 48,36.75 47.75,37 47.75,37.75 47.5,38
  pour Bottom: 47,38.5 48.5,38.5 48.5,36.5 47,36.5
SYS_5V
  Top 0.254: 59.69,52.7 59.69,52.07 | 59.69,52.07 59.69,50.8 | 59.69,50.8 59.69,50.16 | 59.69,52.07 U$2.53 | 59.69,50.8 U$2.54
TS  (via drill 0.6)
  Top 0.305: CN1.2 10.5,38 13,40.5 13,45 14.5,46.5 16.5,46.5 18.5,44.5 v18.5,43.5
  Bottom 0.254: 22,48 22,44.5 19.5,44.5 v18.5,43.5
  Bottom 0.305: 30.87,44.92 R10.2 31.23,46 35.5,46 36.58,44.92 GND.1 | 30.87,44.92 R9.2 | 30.87,44.92 31,44.92 31,48 22,48
VDD_3V3EXP  (via drill 0.6)
  Top 0.406: U$2.50 65,50.16 65,22.5 58,15.5 52.5,15.5 50.5,13.5 45,13.5 42.5,11 42.5,7.5 41.5,6.5 26.5,6.5 v25,8
  Bottom 0.305: R11.1 25.5,11.5 25,12
  Bottom 0.406: U$2.49 U$2.50 | v25,8 25,12 25,12.5 26,13.5 30.36,13.5 U3.8 29.36,14.5 C21.1
VDD_5V  (via drill 0.61)
  Top 0.254: U$2.51 62.23,52.07 62.23,50.8 U$2.52 62.23,49.53 62.23,40.64 v63.5,39.37
  Bottom 0.254: v63.5,39.37 63.5,15.24 C25.1 | 62.23,46.99 62.23,47 62.23,49.53 U$2.52 | U2.1 52.67,39.17 52.67,39.83 52,40.5 48.5,40.5 48,40 48,39.5 48.33,39.17 U2.10
  Bottom 0.406: 52,40.5 52,46
  Bottom 0.61: 52,46 53,47 62.23,47 64.36,47 C22.1